# EAGLE design BradBoxV4 (EAGLE 6.3)
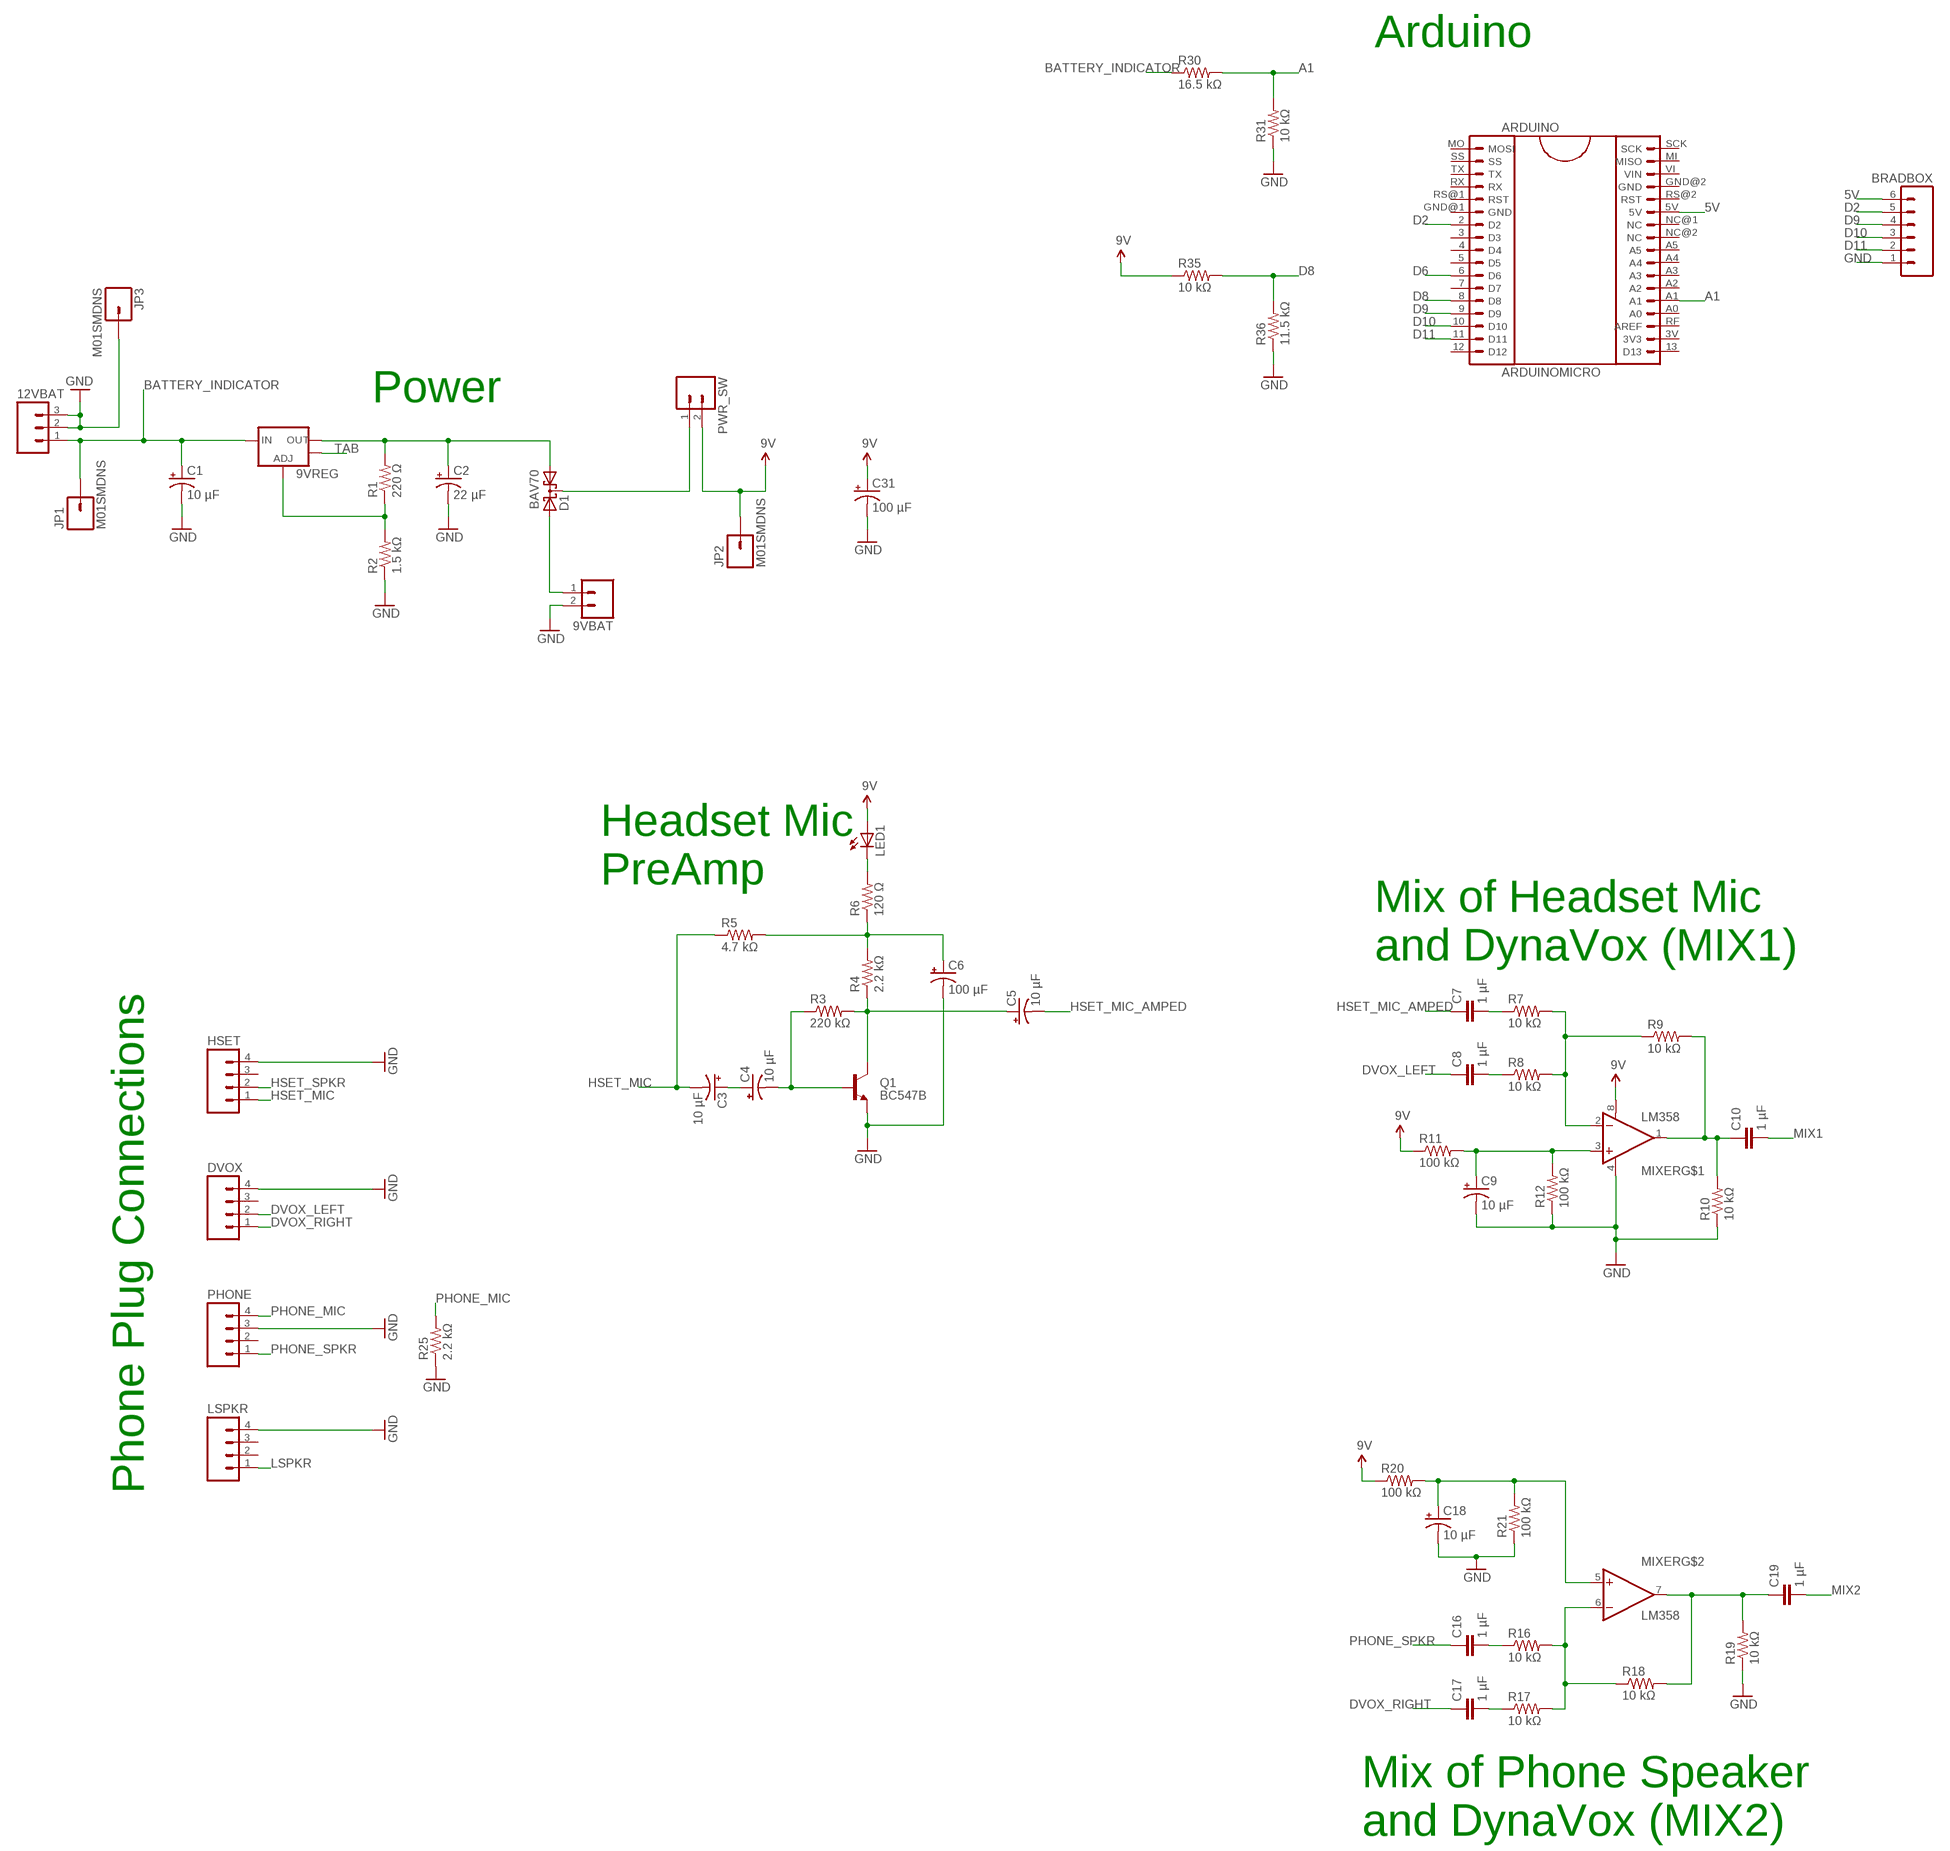
[diagram p0: schematic, sheet 1, part 1 of 2]
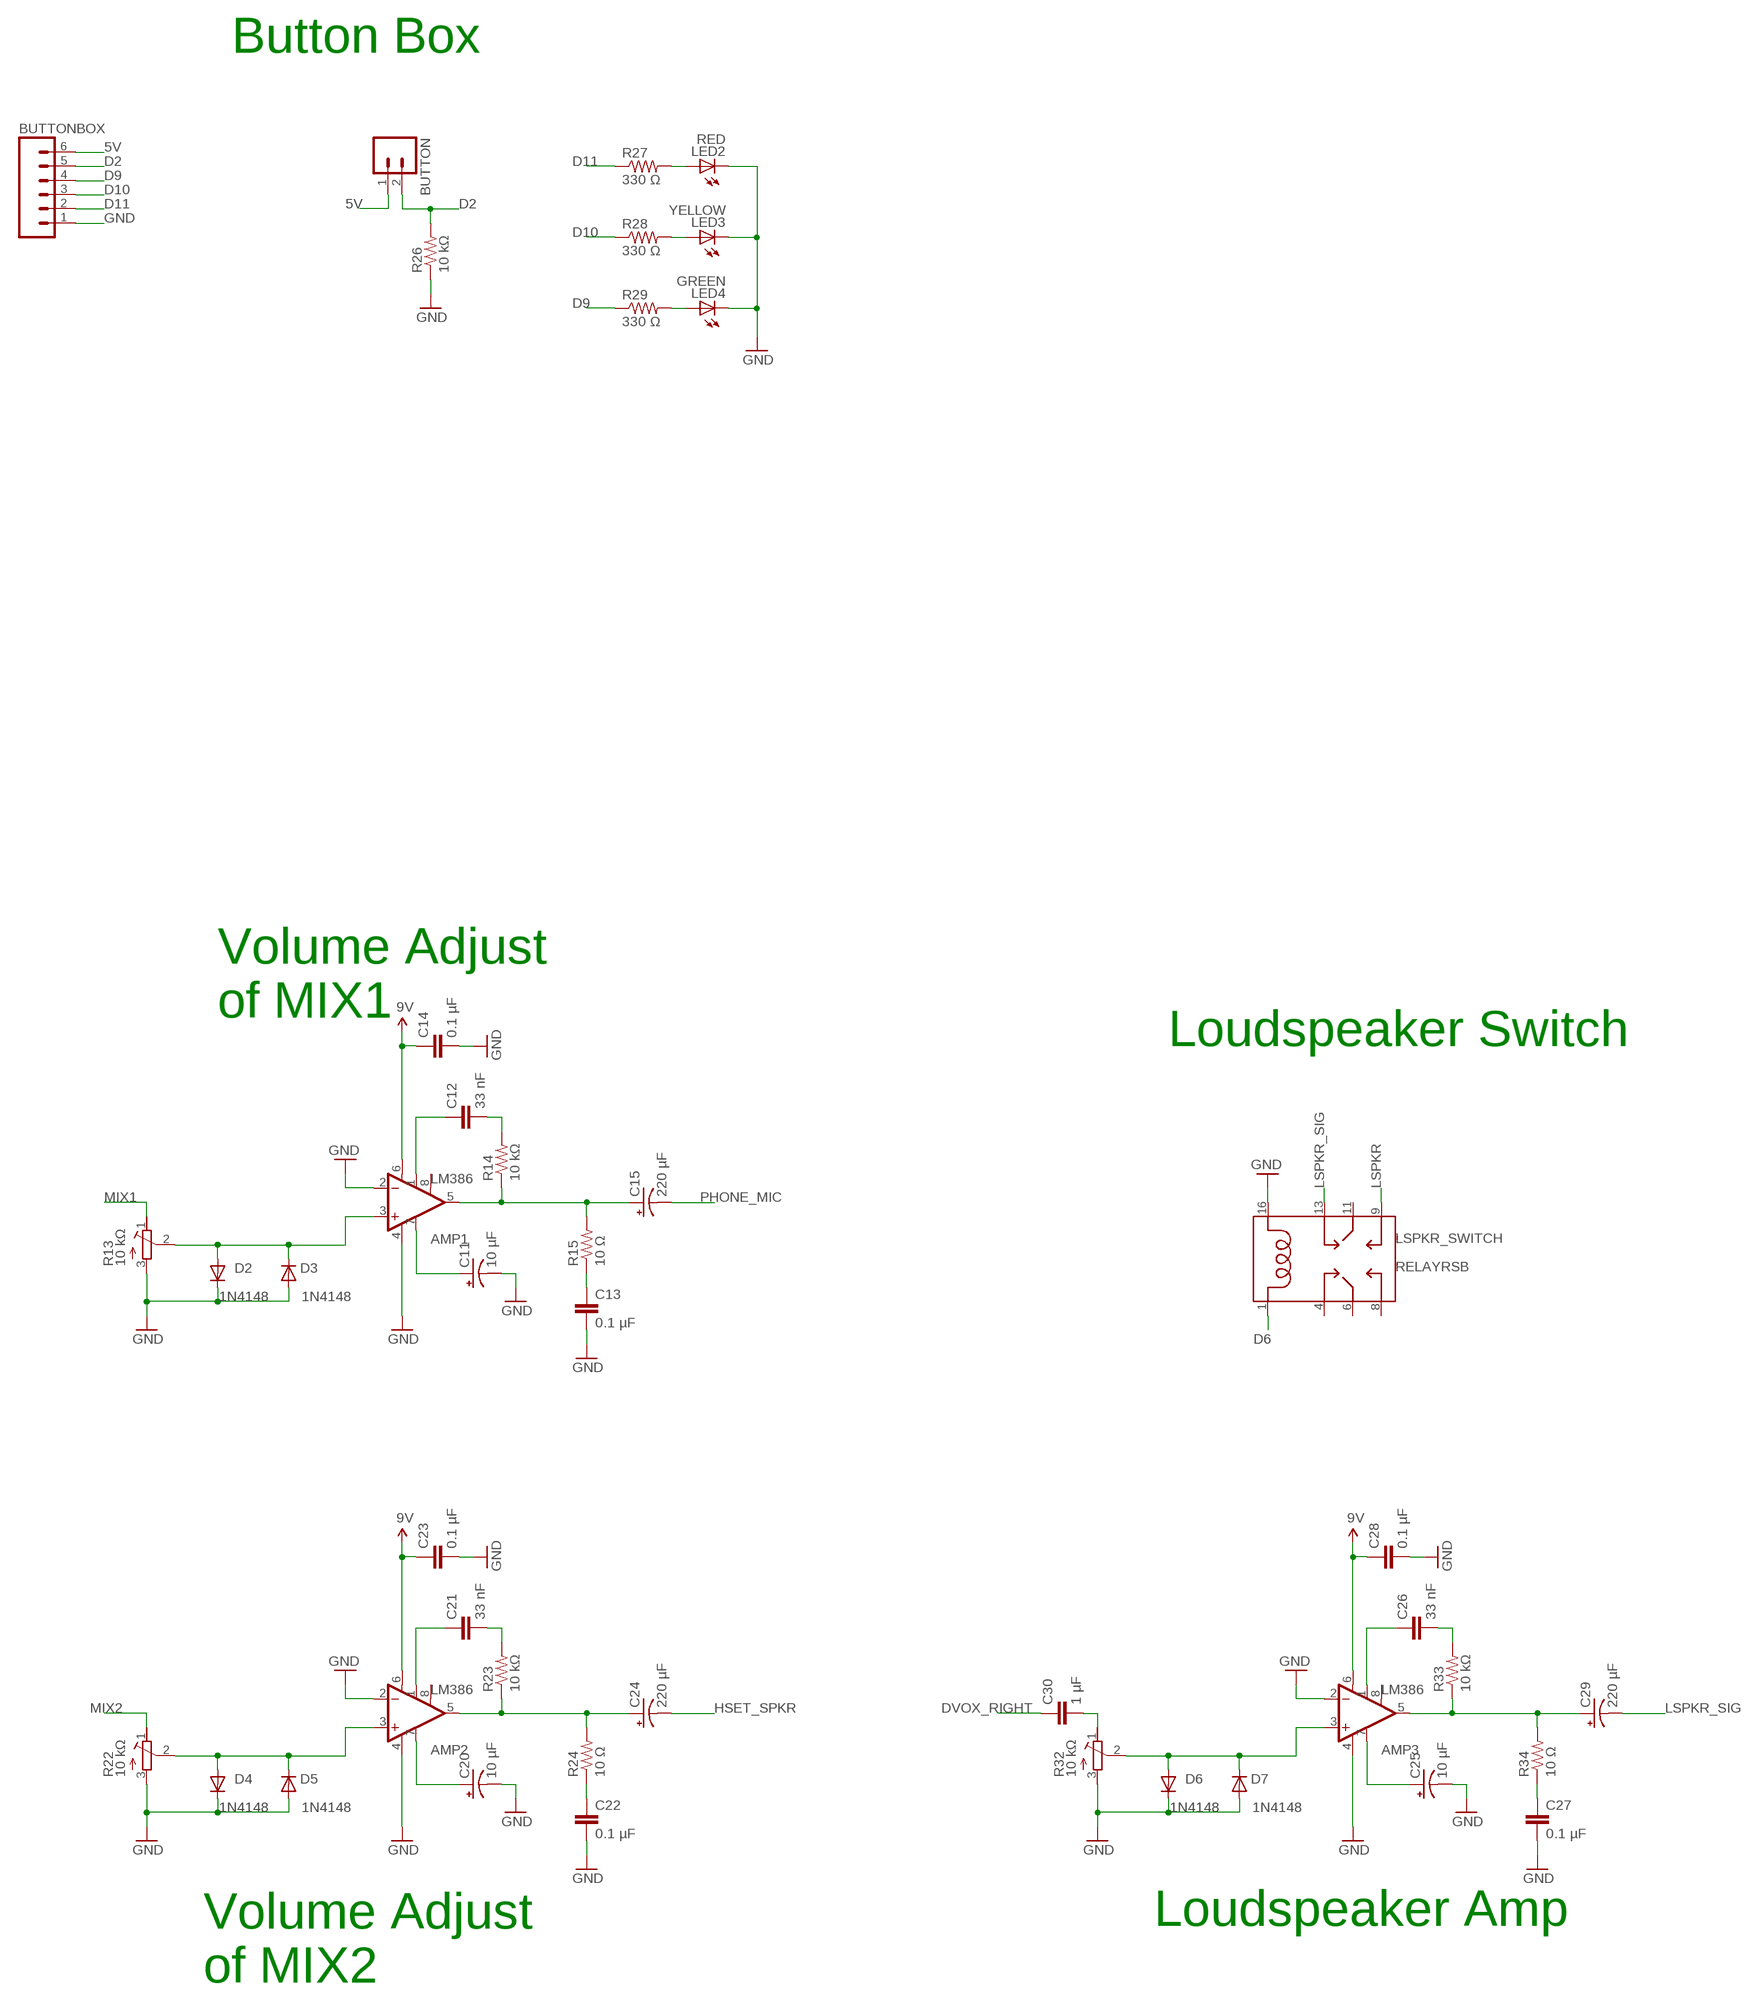
[diagram p1: schematic, sheet 1, part 2 of 2]

## Parts
9VBAT  M02POLAR  [MOLEX-1X2]
9VREG  V_REG_LM1117SOT223  [SOT223]
12VBAT  M03POLAR  [MOLEX-1X3]
AMP1  LM386  [DIP08]
AMP2  LM386  [DIP08]
AMP3  LM386  [DIP08]
ARDUINO  ARDUINOMICRO  [ARDUINO_MICRO]
BRADBOX  M06POLAR  [MOLEX-1X6]
BUTTON  M02POLAR  [MOLEX-1X2]
BUTTONBOX  M06POLAR  [MOLEX-1X6]
C1  10 µF  CAP_POL0603-POL  [0603-CAP-POL]
C2  22 µF  CAP_POL0603-POL  [0603-CAP-POL]
C3  10 µF  CAP_POL0603-POL  [0603-CAP-POL]
C4  10 µF  CAP_POL0603-POL  [0603-CAP-POL]
C5  10 µF  CAP_POL0603-POL  [0603-CAP-POL]
C6  100 µF  CAP_POLPTH1  [CPOL-RADIAL-100UF-100V]
C7  1 µF  CAP0603-CAP  [0603-CAP]
C8  1 µF  CAP0603-CAP  [0603-CAP]
C9  10 µF  CAP_POL0603-POL  [0603-CAP-POL]
C10  1 µF  CAP0603-CAP  [0603-CAP]
C11  10 µF  CAP_POL0603-POL  [0603-CAP-POL]
C12  33 nF  CAP0603-CAP  [0603-CAP]
C13  0.1 µF  CAP0603-CAP  [0603-CAP]
C14  0.1 µF  CAP0603-CAP  [0603-CAP]
C15  220 µF  CAP_POLPTH4  [CPOL-RADIAL-220UF-100V]
C16  1 µF  CAP0603-CAP  [0603-CAP]
C17  1 µF  CAP0603-CAP  [0603-CAP]
C18  10 µF  CAP_POL0603-POL  [0603-CAP-POL]
C19  1 µF  CAP0603-CAP  [0603-CAP]
C20  10 µF  CAP_POL0603-POL  [0603-CAP-POL]
C21  33 nF  CAP0603-CAP  [0603-CAP]
C22  0.1 µF  CAP0603-CAP  [0603-CAP]
C23  0.1 µF  CAP0603-CAP  [0603-CAP]
C24  220 µF  CAP_POLPTH4  [CPOL-RADIAL-220UF-100V]
C25  10 µF  CAP_POL0603-POL  [0603-CAP-POL]
C26  33 nF  CAP0603-CAP  [0603-CAP]
C27  0.1 µF  CAP0603-CAP  [0603-CAP]
C28  0.1 µF  CAP0603-CAP  [0603-CAP]
C29  220 µF  CAP_POLPTH4  [CPOL-RADIAL-220UF-100V]
C30  1 µF  CAP0603-CAP  [0603-CAP]
C31  100 µF  CAP_POLPTH1  [CPOL-RADIAL-100UF-100V]
D1  BAV70  BAS70-05  [SOT23]
D2  1N4148  DIODE-SOD523F  [SOD523F]
D3  1N4148  DIODE-SOD523F  [SOD523F]
D4  1N4148  DIODE-SOD523F  [SOD523F]
D5  1N4148  DIODE-SOD523F  [SOD523F]
D6  1N4148  DIODE-SOD523F  [SOD523F]
D7  1N4148  DIODE-SOD523F  [SOD523F]
DVOX  M04POLAR  [MOLEX-1X4]
HSET  M04POLAR  [MOLEX-1X4]
JP1  M01SMDNS  [1X01NS]
JP2  M01SMDNS  [1X01NS]
JP3  M01SMDNS  [1X01NS]
LED1  LED0603  [LED-0603]
LED2  RED  LED5MM  [LED5MM]
LED3  YELLOW  LED5MM  [LED5MM]
LED4  GREEN  LED5MM  [LED5MM]
LSPKR  M04POLAR  [MOLEX-1X4]
LSPKR_SWITCH  RELAYRSB  [RELAY-RSB]
MIXER  LM358  [DIP08]
PHONE  M04POLAR  [MOLEX-1X4]
PWR_SW  M02POLAR  [MOLEX-1X2]
Q1  BC547B  TRANSISTOR_NPNTO-92-AMMO  [TO-92-AMMO]
R1  220 Ω  R-US_R0603  [R0603]
R2  1.5 kΩ  R-US_R0603  [R0603]
R3  220 kΩ  R-US_R0603  [R0603]
R4  2.2 kΩ  R-US_R0603  [R0603]
R5  4.7 kΩ  R-US_R0603  [R0603]
R6  120 Ω  R-US_R0603  [R0603]
R7  10 kΩ  R-US_R0603  [R0603]
R8  10 kΩ  R-US_R0603  [R0603]
R9  10 kΩ  R-US_R0603  [R0603]
R10  10 kΩ  R-US_R0603  [R0603]
R11  100 kΩ  R-US_R0603  [R0603]
R12  100 kΩ  R-US_R0603  [R0603]
R13  10 kΩ  R-TRIMMT93YA  [RTRIMT93YA]
R14  10 kΩ  R-US_R0603  [R0603]
R15  10 Ω  R-US_R0603  [R0603]
R16  10 kΩ  R-US_R0603  [R0603]
R17  10 kΩ  R-US_R0603  [R0603]
R18  10 kΩ  R-US_R0603  [R0603]
R19  10 kΩ  R-US_R0603  [R0603]
R20  100 kΩ  R-US_R0603  [R0603]
R21  100 kΩ  R-US_R0603  [R0603]
R22  10 kΩ  R-TRIMMT93YA  [RTRIMT93YA]
R23  10 kΩ  R-US_R0603  [R0603]
R24  10 Ω  R-US_R0603  [R0603]
R25  2.2 kΩ  R-US_R0603  [R0603]
R26  10 kΩ  R-US_R0603  [R0603]
R27  330 Ω  R-US_R0603  [R0603]
R28  330 Ω  R-US_R0603  [R0603]
R29  330 Ω  R-US_R0603  [R0603]
R30  16.5 kΩ  R-US_R0603  [R0603]
R31  10 kΩ  R-US_R0603  [R0603]
R32  10 kΩ  R-TRIMMT93YA  [RTRIMT93YA]
R33  10 kΩ  R-US_R0603  [R0603]
R34  10 Ω  R-US_R0603  [R0603]
R35  10 kΩ  R-US_R0603  [R0603]
R36  11.5 kΩ  R-US_R0603  [R0603]

## Nets
5V: ARDUINO.5V BRADBOX.6 BUTTON.1 BUTTONBOX.6
9V: AMP1.6(V+) AMP2.6(V+) AMP3.6(V+) C14.1 C23.1 C28.1 C31.1(+) JP2.1 LED1.A MIXER.8(V+) PWR_SW.2 R11.1 R20.1 R35.1
A1: ARDUINO.A1 R30.2 R31.2
BATTERY_INDICATOR: 9VREG.3(IN) 12VBAT.1 C1.1(+) JP1.1 R30.1
D2: ARDUINO.2(D2) BRADBOX.5 BUTTON.2 BUTTONBOX.5 R26.2
D6: ARDUINO.6(D6) LSPKR_SWITCH.1
D8: ARDUINO.8(D8) R35.2 R36.2
D9: ARDUINO.9(D9) BRADBOX.4 BUTTONBOX.4 R29.1
D10: ARDUINO.10(D10) BRADBOX.3 BUTTONBOX.3 R28.1
D11: ARDUINO.11(D11) BRADBOX.2 BUTTONBOX.2 R27.1
DVOX_LEFT: C8.1 DVOX.2
DVOX_RIGHT: C17.1 C30.1 DVOX.1
GND: 9VBAT.2 12VBAT.2 12VBAT.3 AMP1.2(-IN) AMP1.4(V-) AMP2.2(-IN) AMP2.4(V-) AMP3.2(-IN) AMP3.4(V-) BRADBOX.1 BUTTONBOX.1 C1.2(-) C2.2(-) C6.2(-) C9.2(-) C11.2(-) C13.2 C14.2 C18.2(-) C20.2(-) C22.2 C23.2 C25.2(-) C27.2 C28.2 C31.2(-) D2.C D3.A D4.C D5.A D6.C D7.A DVOX.4 HSET.4 JP3.1 LED2.K(C) LED3.K(C) LED4.K(C) LSPKR.4 LSPKR_SWITCH.16 MIXER.4(V-) PHONE.3 Q1.1(E) R2.1 R10.1 R12.1 R13.3(E) R19.1 R21.1 R22.3(E) R25.1 R26.1 R31.1 R32.3(E) R36.1
HSET_MIC: C3.2(-) HSET.1 R5.1
HSET_MIC_AMPED: C5.2(-) C7.1
HSET_SPKR: C24.2(-) HSET.2
LSPKR: LSPKR.1 LSPKR_SWITCH.9
LSPKR_SIG: C29.2(-) LSPKR_SWITCH.13
MIX1: C10.2 R13.1(A)
MIX2: C19.2 R22.1(A)
N$1: 9VREG.2(OUT) C2.1(+) D1.1(A1) R1.2
N$2: 9VREG.1(ADJ) R1.1 R2.2
N$3: AMP3.3(+IN) D6.A D7.C R32.2(S)
N$4: D1.3(C) PWR_SW.1
N$5: 9VBAT.1 D1.2(A2)
N$6: C3.1(+) C4.1(+)
N$7: C4.2(-) Q1.2(B) R3.1
N$8: C5.1(+) Q1.3(C) R3.2 R4.1
N$9: LED1.C R6.2
N$10: C6.1(+) R4.2 R5.2 R6.1
N$11: C8.2 R8.1
N$12: C7.2 R7.1
N$13: MIXER.2(-IN) R7.2 R8.2 R9.1
N$14: C10.1 MIXER.1(OUT) R9.2 R10.2
N$15: C9.1(+) MIXER.3(+IN) R11.2 R12.2
N$16: AMP1.1(GAIN) C12.1
N$17: C12.2 R14.2
N$18: AMP1.3(+IN) D2.A D3.C R13.2(S)
N$19: AMP1.5(OUT) C15.1(+) R14.1 R15.2
N$20: AMP1.7(BP) C11.1(+)
N$21: C13.1 R15.1
N$22: C17.2 R17.1
N$23: C16.2 R16.1
N$24: C18.1(+) MIXER.5(+IN) R20.2 R21.2
N$25: MIXER.6(-IN) R16.2 R17.2 R18.1
N$26: C19.1 MIXER.7(OUT) R18.2 R19.2
N$27: AMP2.3(+IN) D4.A D5.C R22.2(S)
N$28: AMP2.7(BP) C20.1(+)
N$29: AMP2.1(GAIN) C21.1
N$30: C21.2 R23.2
N$31: AMP2.5(OUT) C24.1(+) R23.1 R24.2
N$32: C22.1 R24.1
N$34: LED2.A R27.2
N$35: LED3.A R28.2
N$36: LED4.A R29.2
N$37: AMP3.7(BP) C25.1(+)
N$38: AMP3.1(GAIN) C26.1
N$39: C26.2 R33.2
N$40: AMP3.5(OUT) C29.1(+) R33.1 R34.2
N$41: C27.1 R34.1
N$42: C30.2 R32.1(A)
PHONE_MIC: C15.2(-) PHONE.4 R25.2
PHONE_SPKR: C16.1 PHONE.1
TAB: 9VREG.4(OUT)
Unconnected: AMP1.8(GAIN) AMP2.8(GAIN) AMP3.8(GAIN) ARDUINO.3(D3) ARDUINO.3V(3V3) ARDUINO.4(D4) ARDUINO.5(D5) ARDUINO.7(D7) ARDUINO.12(D12) ARDUINO.13(D13) ARDUINO.A0 ARDUINO.A2 ARDUINO.A3 ARDUINO.A4 ARDUINO.A5 ARDUINO.GND@1(GND) ARDUINO.GND@2(GND) ARDUINO.MI(MISO) ARDUINO.MO(MOSI) ARDUINO.NC@1(NC) ARDUINO.NC@2(NC) ARDUINO.RF(AREF) ARDUINO.RS@1(RST) ARDUINO.RS@2(RST) ARDUINO.RX ARDUINO.SCK ARDUINO.SS ARDUINO.TX ARDUINO.VI(VIN) DVOX.3 HSET.3 LSPKR.2 LSPKR.3 LSPKR_SWITCH.4 LSPKR_SWITCH.6 LSPKR_SWITCH.8 LSPKR_SWITCH.11 PHONE.2

## Notes on the sheet
- Arduino
- Button Box
- Power
- Headset Mic 
  PreAmp
- Mix of Headset Mic
  and DynaVox (MIX1)
- Volume Adjust
  of MIX1
- Loudspeaker Switch
- Phone Plug Connections
- Loudspeaker Amp
- Mix of Phone Speaker
  and DynaVox (MIX2)
- Volume Adjust
  of MIX2

## Library data of the parts
9VBAT BUTTON PWR_SW = BradBoxV4:M02: Header 2 Standard 2-pin 0.1" header. Use with straight break away headers (SKU : PRT-00116), right angle break away headers (PRT-00553), swiss pins (PRT-00743), machine pins (PRT-00117), and female headers (PRT-00115). Molex polarized connector foot print use with SKU : PRT-08233 with associated crimp pins and housings.
9VREG = BradBoxV4:V_REG_LM1117: Voltage Regulator LM1117 Standard adjustable voltage regulator but in SMD form. Spark Fun Electronics SKU : COM-00595
12VBAT = BradBoxV4:M03: Header 3 Standard 3-pin 0.1" header. Use with straight break away headers (SKU : PRT-00116), right angle break away headers (PRT-00553), swiss pins (PRT-00743), machine pins (PRT-00117), and female headers (PRT-00115). Molex polarized connector foot print use with SKU : PRT-08232 with associated crimp pins and housings.
AMP1-AMP3 = BradBoxV4:LM386: low voltage audio power amplifier
ARDUINO = BradBoxV4:ARDUINO
BRADBOX BUTTONBOX = BradBoxV4:M06: Header 6 Standard 6-pin 0.1" header. Use with straight break away headers (SKU : PRT-00116), right angle break away headers (PRT-00553), swiss pins (PRT-00743), machine pins (PRT-00117), and female headers (PRT-00115). Molex polarized connector foot print use with SKU : PRT-08094 with associated crimp pins and housings. NOTES ON THE VARIANTS LOCK and LOCK_LONGPADS... This footprint was designed to help hold the alignment of a through-hole component (i.e. 6-pin header) while soldering it into place. You may notice that each hole has been shifted either up or down by 0.005 of an inch from it's more standard position (which is a perfectly straight line). This slight alteration caused the pins (the squares in the middle) to touch the edges of the holes. Because they are alternating, it causes a "brace" to hold the component in place. 0.005 has proven to be the perfect amount of "off-center" position when using our standard breakaway headers. Although looks a little odd when you look at the bare footprint, once you have a header in there, the alteration is very hard to notice. Also, if you push a header all the way into place, it is covered up entirely on the bottom side. This idea of altering the position of holes to aid alignment will be further integrated into the Sparkfun Library for other footprints. It can help hold any component with 3 or more connection pins.
C1-C6 C9 C11 C15 C18 C20 C24 C25 C29 C31 = BradBoxV4:CAP_POL: Capacitor Polarized These are standard SMD and PTH capacitors. Normally 10uF, 47uF, and 100uF in electrolytic and tantalum varieties. Always verify the external diameter of the through hole cap, it varies with capacity, voltage, and manufacturer. The EIA devices should be standard.
C7 C8 C10 C12-C14 C16 C17 C19 C21-C23 C26-C28 C30 = BradBoxV4:CAP: Capacitor Standard 0603 ceramic capacitor, and 0.1" leaded capacitor.
D1 = BradBoxV4:BAS70-05: Silicon Schottky Diodes General-purpose diode for high-speed switching
D2-D7 = BradBoxV4:DIODE-: DIODE
DVOX HSET LSPKR PHONE = BradBoxV4:M04: Header 4 Standard 4-pin 0.1" header. Use with straight break away headers (SKU : PRT-00116), right angle break away headers (PRT-00553), swiss pins (PRT-00743), machine pins (PRT-00117), and female headers (PRT-00115). Molex polarized connector foot print use with SKU : PRT-08231 with associated crimp pins and housings. 1MM SMD Version SKU: PRT-10208
JP1-JP3 = BradBoxV4:M01: Header 1 Standard 1-pin 0.1" header. Use with straight break away headers (SKU : PRT-00116), right angle break away headers (PRT-00553), swiss pins (PRT-00743), machine pins (PRT-00117), and female headers (PRT-00115).
LED1-LED4 = BradBoxV4:LED: LEDs Standard schematic elements and footprints for 5mm, 3mm, 1206, and 0603 sized LEDs. 5mm - Spark Fun Electronics SKU : COM-00529 (and others)
LSPKR_SWITCH = BradBoxV4:RELAY: SPDT relay (COM-00101)
MIXER = BradBoxV4:LM358
Q1 = BradBoxV4:TRANSISTOR_NPN: Generic NPN BJT. MMBT2222 is the common NPN we use. Double check against datasheet- not all devices are the same!
R1-R12 R14-R21 R23-R31 R33-R36 = BradBoxV4:R-US_: RESISTOR, American symbol
R13 R22 R32 = BradBoxV4:R-TRIMM: Trimm resistor

## Board
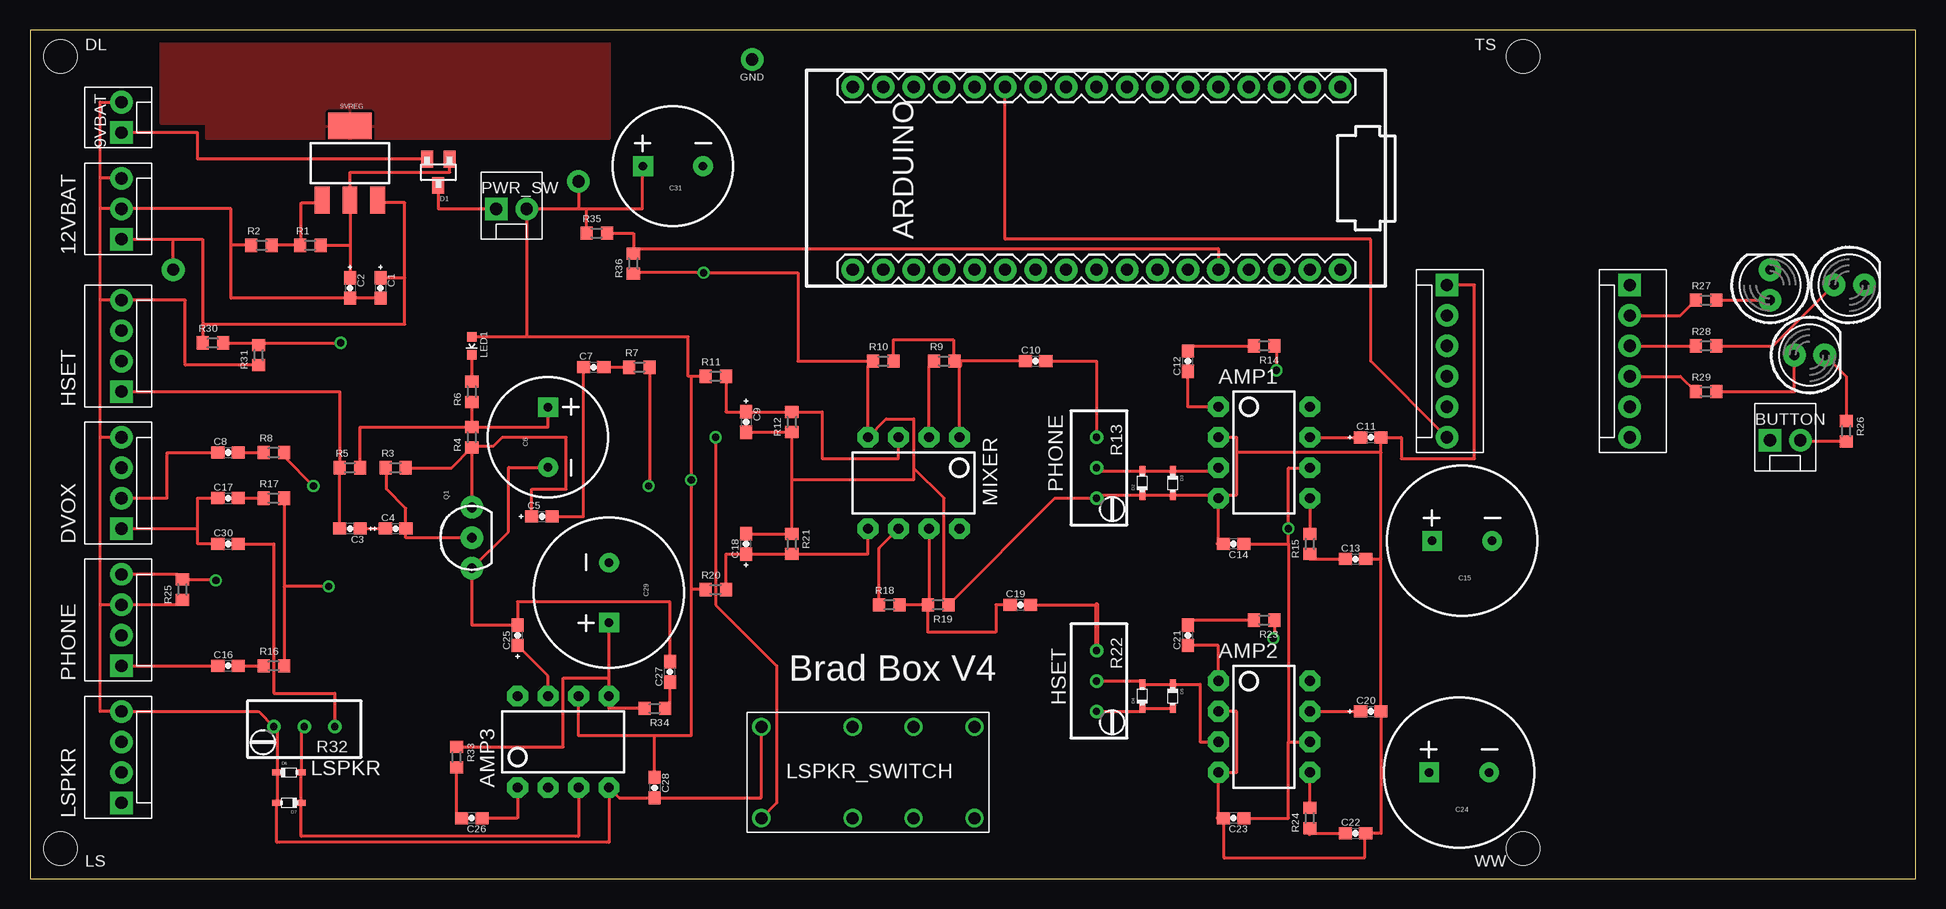
[diagram p2: board, top side]
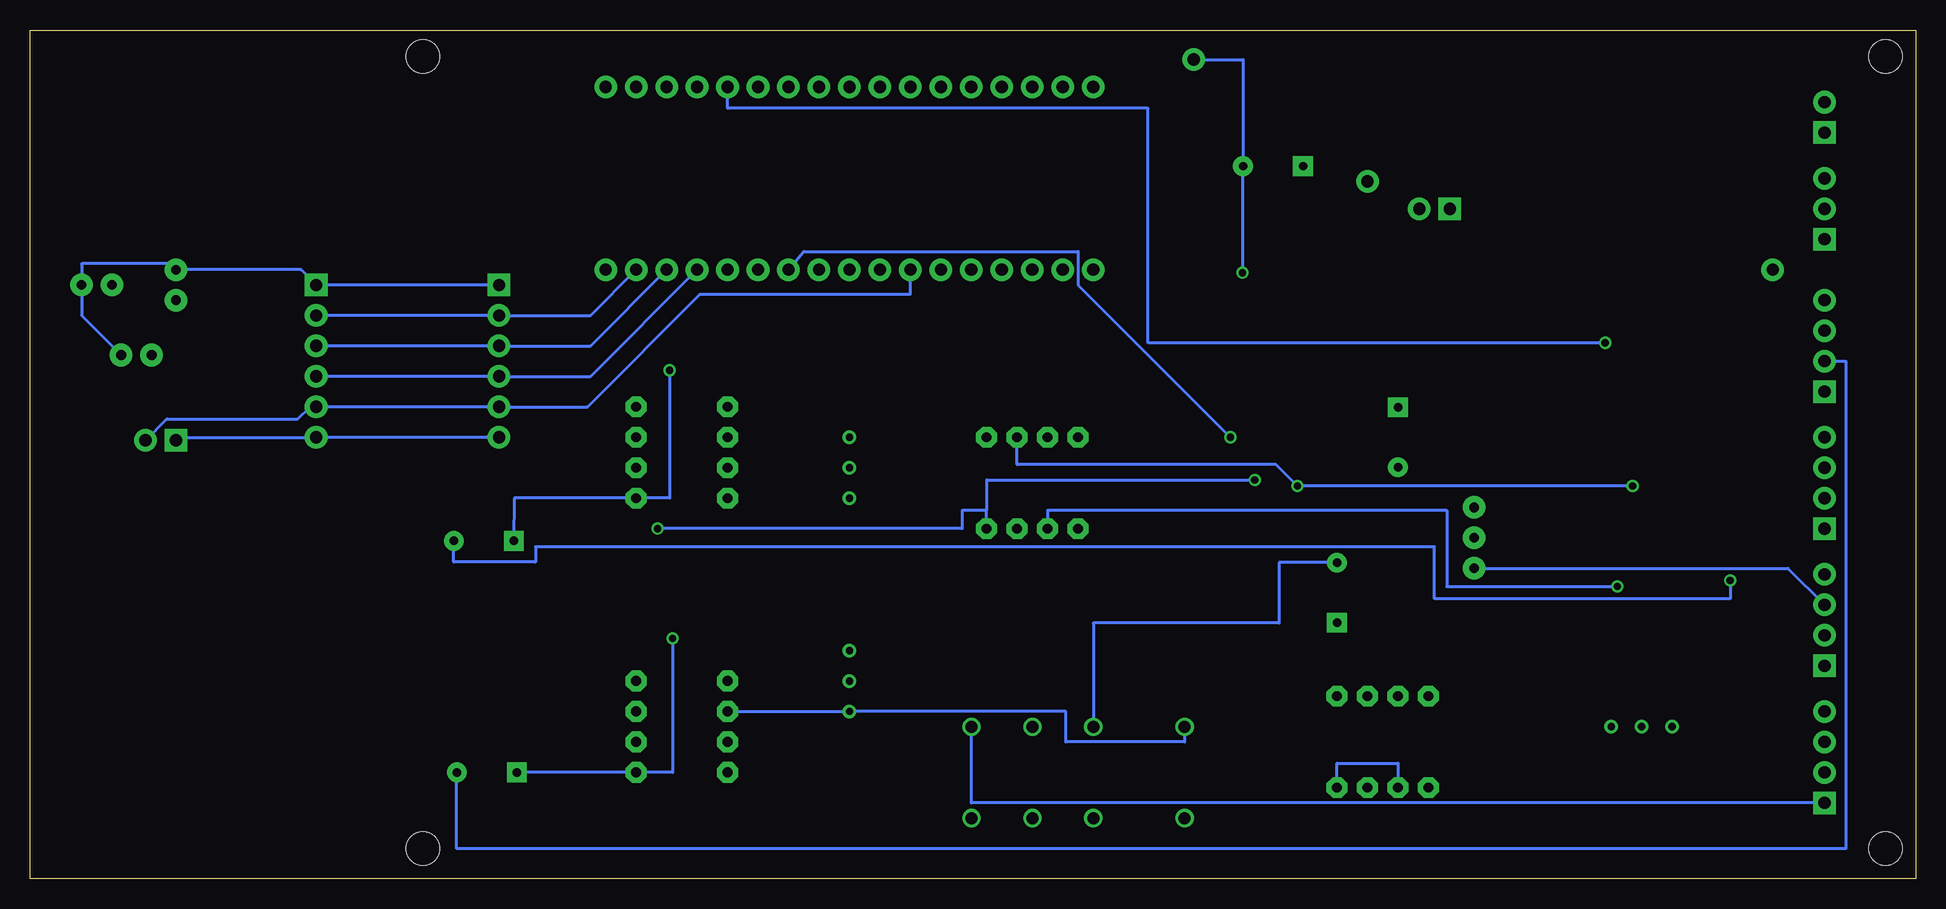
[diagram p3: board, bottom side, seen from below]

Size 157.21 x 70.79 mm. Coordinates in mm from the lower left corner, seen from the top.
Outline: 0,0 157.21,0 157.21,70.79 0,70.79 0,0
Copper layers (1*16): Top 0.035mm / dielectric 1.5mm / Bottom 0.035mm
Design rules "default": minimum track width 10mil, minimum drill 24mil, track to track 8mil, track to pad 8mil, pad to pad 8mil, via to via 8mil, smd to smd 8mil, copper to edge 40mil, drill to drill 8mil, minimum pad ring 10mil, minimum via ring 8mil, stop-mask expansion 4mil, vias tented up to drill 0mil, thermal gap 10mil
Holes 2.8 mm at 2.54,2.54 2.54,68.58 124.46,2.54 124.46,68.58

### Footprints (pad centres in the part's own frame; a part is rotated, then mirrored left to right if it is on the bottom)
MOLEX-1X2 = drill 1.016 pad 1.88 square: 1 0,0 | drill 1.016 pad 1.88: 2 2.54,0
SOT223 = smd 1.219 x 2.235: 1 -2.311,-3.099; 2 0,-3.099; 3 2.311,-3.099 | smd 3.6 x 2.2: 4 0,3.099
MOLEX-1X3 = drill 1.016 pad 1.88 square: 1 0,0 | drill 1.016 pad 1.88: 2 2.54,0; 3 5.08,0
DIP08 = drill 0.813 pad 1.727 octagon: 1 -3.81,-3.81; 2 -1.27,-3.81; 3 1.27,-3.81; 4 3.81,-3.81; 5 3.81,3.81; 6 1.27,3.81; 7 -1.27,3.81; 8 -3.81,3.81
ARDUINO_MICRO = drill 1.016 pad 1.88: 2 -7.62,25.4; 3 -7.62,22.86; 3V 7.62,2.54; 4 -7.62,20.32; 5 -7.62,17.78; 5V 7.62,27.94; 6 -7.62,15.24; 7 -7.62,12.7; 8 -7.62,10.16; 9 -7.62,7.62; 10 -7.62,5.08; 11 -7.62,2.54; 12 -7.62,0; 13 7.62,0; A0 7.62,7.62; A1 7.62,10.16; A2 7.62,12.7; A3 7.62,15.24; A4 7.62,17.78; A5 7.62,20.32; GND@1 -7.62,27.94; GND@2 7.62,33.02; MI 7.62,38.1; MO -7.62,40.64; NC@1 7.62,25.4; NC@2 7.62,22.86; RF 7.62,5.08; RS@1 -7.62,30.48; RS@2 7.62,30.48; RX -7.62,33.02; SCK 7.62,40.64; SS -7.62,38.1; TX -7.62,35.56; VI 7.62,35.56
MOLEX-1X6 = drill 1.016 pad 1.88 square: 1 0,0 | drill 1.016 pad 1.88: 2 2.54,0; 3 5.08,0; 4 7.62,0; 5 10.16,0; 6 12.7,0
0603-CAP-POL = smd 1.1 x 1: 1 -0.85,0; 2 0.85,0
CPOL-RADIAL-100UF-100V = drill 0.7 pad 1.651 square: 1 2.5,0 | drill 0.7 pad 1.651: 2 -2.5,0
0603-CAP = smd 1.1 x 1: 1 -0.85,0; 2 0.85,0
CPOL-RADIAL-220UF-100V = drill 0.7 pad 1.651 square: 1 2.5,0 | drill 0.7 pad 1.651: 2 -2.5,0
SOT23 = smd 1 x 1.4: 1 -0.95,-1.1; 2 0.95,-1.1; 3 0,1.1
SOD523F = smd 0.8 x 0.5: A 1,0; C -1,0
MOLEX-1X4 = drill 1.016 pad 1.88 square: 1 0,0 | drill 1.016 pad 1.88: 2 2.54,0; 3 5.08,0; 4 7.62,0
1X01NS = drill 1.016 pad 1.88: 1 0,0
LED-0603 = smd 0.8 x 0.8: A 0,-0.75; C 0,0.75
LED5MM = drill 0.813 pad 1.88: A -1.27,0; K 1.27,0
RELAY-RSB = drill 1: 1 -8.89,-3.81; 4 -1.27,-3.81; 6 3.81,-3.81; 8 8.89,-3.81; 9 8.89,3.81; 11 3.81,3.81; 13 -1.27,3.81; 16 -8.89,3.81
TO-92-AMMO = drill 0.813 pad 1.88: 1 -2.54,0; 2 0,0; 3 2.54,0
R0603 = smd 1 x 1.1: 1 -0.85,0; 2 0.85,0
RTRIMT93YA = drill 0.61: 1 0,-2.54; 2 0,0; 3 0,2.54

### Placement (x,y rotation side)
9VBAT  7.62,62.23 90 top
9VREG  26.67,59.69 0 top
12VBAT  7.62,53.34 90 top
AMP1  102.87,35.56 270 top
AMP2  102.87,12.7 270 top
AMP3  44.45,11.43 0 top
ARDUINO  109.22,58.42 90 top
BRADBOX  118.11,49.53 270 top
BUTTON  145.03,36.58 0 top
BUTTONBOX  133.35,49.53 270 top
C1  29.21,49.28 270 top
C2  26.67,49.28 270 top
C3  26.67,29.21 180 top
C4  30.48,29.21 0 top
C5  42.67,30.23 0 top
C6  43.18,36.83 90 top
C7  46.99,42.67 0 top
C8  16.51,35.56 0 top
C9  59.69,38.1 270 top
C10  83.82,43.18 0 top
C11  111.76,36.83 0 top
C12  96.52,43.18 90 top
C13  110.49,26.67 0 top
C14  100.33,27.94 180 top
C15  119.38,28.19 180 top
C16  16.51,17.78 0 top
C17  16.51,31.75 0 top
C18  59.69,27.94 90 top
C19  82.55,22.86 0 top
C20  111.76,13.97 0 top
C21  96.52,20.32 90 top
C22  110.49,3.81 0 top
C23  100.33,5.08 180 top
C24  119.13,8.89 180 top
C25  40.64,20.32 90 top
C26  36.83,5.08 180 top
C27  53.34,17.27 90 top
C28  52.07,7.62 270 top
C29  48.26,23.88 270 top
C30  16.51,27.94 0 top
C31  53.59,59.44 180 top
D1  34.04,58.93 180 top
D2  92.71,33.02 90 top
D3  95.25,33.02 270 top
D4  92.71,15.24 90 top
D5  95.25,15.24 270 top
D6  21.59,8.89 0 top
D7  21.59,6.35 180 top
DVOX  7.62,29.21 90 top
HSET  7.62,40.64 90 top
JP1  11.94,50.8 0 top
JP2  45.72,58.17 0 top
JP3  60.2,68.33 0 top
LED1  36.83,44.45 180 top
LED2  145.03,49.53 90 top
LED3  151.64,49.53 0 top
LED4  148.34,43.69 0 top
LSPKR  7.62,6.35 90 top
LSPKR_SWITCH  69.85,8.89 0 top
MIXER  73.66,33.02 180 top
PHONE  7.62,17.78 90 top
PWR_SW  38.86,55.88 0 top
Q1  36.83,28.45 90 top
R1  23.37,52.83 0 top
R2  19.3,52.83 0 top
R3  30.48,34.29 0 top
R4  36.83,36.83 90 top
R5  26.67,34.29 0 top
R6  36.83,40.64 90 top
R7  50.8,42.67 0 top
R8  20.32,35.56 0 top
R9  76.2,43.18 0 top
R10  71.12,43.18 0 top
R11  57.15,41.91 0 top
R12  63.5,38.1 90 top
R13  88.9,34.29 180 top
R14  102.87,44.45 180 top
R15  106.68,27.94 90 top
R16  20.32,17.78 0 top
R17  20.32,31.75 0 top
R18  71.63,22.86 0 top
R19  75.69,22.86 180 top
R20  57.15,24.13 0 top
R21  63.5,27.94 270 top
R22  88.9,16.51 180 top
R23  102.87,21.59 180 top
R24  106.68,5.08 90 top
R25  12.7,24.13 90 top
R26  151.38,37.34 270 top
R27  139.7,48.26 0 top
R28  139.7,44.45 0 top
R29  139.7,40.64 0 top
R30  15.24,44.7 0 top
R31  19.05,43.69 90 top
R32  22.86,12.7 90 top
R33  35.56,10.16 270 top
R34  52.07,14.22 180 top
R35  47.24,53.85 0 top
R36  50.29,51.31 90 top

### Tracks (layer width: path | path; a pad name or v marks a point on that pad's centre or on a via)
5V
  Top 0.254: BRADBOX.6 111.76,43.18 111.76,53.34 81.28,53.34 ARDUINO.5V
  Bottom 0.254: BUTTON.1 144.78,36.83 BUTTONBOX.6 BRADBOX.6
9V  (via drill 0.6)
  Top 0.254: 45.72,55.88 PWR_SW.2 41.4,45.2 | 45.72,55.88 46.39,55.88 | 46.39,55.88 51.05,55.88 51.05,59.4 | R35.1 46.39,55.88 | 41.4,45.2 LED1.A | 41.4,45.2 54.86,45.2 54.86,41.91 R11.1 55.12,41.91 v55.12,33.27 55.12,24.13 | C28.1 52.07,11.94 | 52.07,11.94 45.72,11.94 AMP3.6 | 55.12,24.13 55.12,11.94 52.07,11.94 | R20.1 55.12,24.13 | C14.1 104.9,27.94 | 104.9,27.94 v104.9,29.21 104.9,34.29 AMP1.6 | C23.1 104.9,5.08 104.9,11.43 | 104.9,11.43 AMP2.6 | 104.9,27.94 104.9,11.43 | JP2.1 45.72,55.88
  Top 0.406: 51.05,59.4 C31.1
  Bottom 0.254: v55.12,33.27 77.47,33.27 77.47,30.73 | 77.47,30.73 79.5,30.73 79.5,29.21 v104.9,29.21 | MIXER.8 77.47,30.73
A1  (via drill 0.6)
  Top 0.254: R30.2 19.05,44.7 | 19.05,44.7 R31.2 | 19.05,44.7 v25.91,44.7
  Bottom 0.254: v25.91,44.7 64.01,44.7 64.01,64.26 99.06,64.26 ARDUINO.A1
BATTERY_INDICATOR
  Top 0.254: 12VBAT.1 11.94,53.34 | 11.94,53.34 14.39,53.34 14.39,46.23 | 14.39,46.23 R30.1 | 14.39,46.23 31.24,46.23 31.24,50.13 | 28.96,56.59 9VREG.3 28.98,56.39 31.24,56.39 31.24,50.13 | C1.1 31.24,50.13 | JP1.1 11.94,53.34
D2
  Top 0.254: R26.2 147.57,36.49 BUTTON.2
  Bottom 0.254: BUTTON.2 145.8,38.35 134.87,38.35 133.86,39.37 BUTTONBOX.5 BRADBOX.5 110.74,39.37 101.35,48.77 83.82,48.77 ARDUINO.2
D6  (via drill 0.61)
  Top 0.254: LSPKR_SWITCH.1 62.23,6.35 62.23,17.78 57.15,22.86 v57.15,36.83
  Bottom 0.254: v57.15,36.83 69.85,49.53 69.85,52.32 92.71,52.32 ARDUINO.6
D8
  Top 0.254: R35.2 50.29,53.85 R36.2 50.29,52.58 99.06,52.58 ARDUINO.8
D9
  Top 0.254: BUTTONBOX.4 137.58,41.91 R29.1
  Bottom 0.254: BUTTONBOX.4 BRADBOX.4 110.49,41.91 ARDUINO.9
D10
  Top 0.254: BUTTONBOX.3 R28.1
  Bottom 0.254: BUTTONBOX.3 BRADBOX.3 110.49,44.45 ARDUINO.10
D11
  Top 0.254: BUTTONBOX.2 137.58,46.99 R27.1
  Bottom 0.254: BUTTONBOX.2 BRADBOX.2 110.49,46.99 ARDUINO.11
DVOX_LEFT
  Top 0.254: DVOX.2 11.43,31.75 11.43,35.56 C8.1
DVOX_RIGHT
  Top 0.254: DVOX.1 13.97,29.21 | 13.97,29.21 13.97,31.75 C17.1 | C30.1 13.97,27.94 13.97,29.21
GND  (via drill 0.6)
  Top 0.254: 5.84,22.86 5.84,13.97 LSPKR.4 19.05,13.97 R32.3 20.59,12.43 D6.C D7.A 20.57,6.35 20.57,3.05 48.26,3.05 AMP3.4 49.11,6.77 C28.2 60.96,6.77 LSPKR_SWITCH.16 | 5.84,22.86 5.84,36.83 | 5.84,36.83 5.84,48.26 | 5.84,48.26 5.84,55.88 | 5.84,55.88 5.84,58.42 | 5.84,58.42 5.84,64.77 9VBAT.2 | 5.84,22.86 PHONE.3 12.28,22.86 R25.1 | DVOX.4 5.84,36.83 | 5.84,48.26 HSET.4 12.95,48.26 12.95,42.84 R31.1 | 12VBAT.3 5.84,58.42 | 5.84,55.88 12VBAT.2 16.76,55.88 16.76,52.83 | 16.76,52.83 16.76,48.43 C2.2 C1.2 | R2.1 16.76,52.83 | LED4.K 151.38,41.91 R26.1 | C9.2 R12.1 63.5,33.27 | 99.06,32.02 D3.A D2.C 88.9,32.02 R13.3 85.43,31.75 R19.1 76.2,22.86 76.2,31.75 73.66,34.29 | 99.06,32.02 AMP1.4 99.06,27.94 | C13.2 112.61,26.67 | 112.61,26.67 112.61,35.56 | 112.61,35.56 C11.2 114.3,36.83 114.3,35.05 120.4,35.05 120.4,49.53 BRADBOX.1 | 50.29,50.55 v56.13,50.55 64.01,50.55 64.01,43.18 R10.1 69.85,42.76 MIXER.4 71.37,38.35 73.66,38.35 73.66,34.29 | 63.5,33.27 R21.1 C18.2 59.69,28.7 | C6.2 39.92,34.33 39.88,34.29 39.88,28.96 Q1.1 36.83,21.17 C25.2 40.64,23.11 53.34,23.11 C27.2 | R22.3 92.71,13.97 D4.C D5.A | 99.06,5.08 AMP2.4 100.58,8.89 100.58,13.97 AMP2.2 | C23.2 99.48,1.78 111.25,1.78 111.25,3.81 | 99.06,32.02 100.58,32.02 100.58,35.56 | 100.58,35.56 100.58,36.83 AMP1.2 | 112.61,26.67 C20.2 112.61,3.81 C22.2 | 112.61,35.56 100.58,35.56 | 73.66,34.29 73.66,33.27 63.5,33.27
  Top 0.406: C14.2 99.06,27.94 | 50.29,50.55 R36.1 | C23.2 99.06,5.08 | 111.25,26.67 C13.2 | 111.25,3.81 C22.2
  Bottom 0.254: BRADBOX.1 BUTTONBOX.1 134.62,50.8 LED2.K 145.54,51.31 152.91,51.31 LED3.K 152.91,46.99 LED4.K | AMP3.4 48.26,9.65 43.18,9.65 AMP3.2 | v56.13,50.55 56.09,50.55 C31.2 56.09,68.33 JP3.1 | AMP2.2 R22.3 70.87,13.97 70.87,11.43 60.96,11.43 LSPKR_SWITCH.16 | Q1.1 10.67,25.91 PHONE.3
HSET_MIC
  Top 0.254: C3.2 R5.1 25.82,40.64 HSET.1
HSET_MIC_AMPED
  Top 0.254: C5.2 46.14,30.23 C7.1
HSET_SPKR
  Bottom 0.254: HSET.2 5.84,43.18 5.84,2.54 121.63,2.54 C24.2
LSPKR
  Bottom 0.254: LSPKR.1 78.74,6.35 LSPKR_SWITCH.9
LSPKR_SIG
  Bottom 0.254: C29.2 53.09,26.38 53.09,21.34 68.58,21.34 LSPKR_SWITCH.13
MIX1
  Top 0.254: C10.2 88.9,43.18 R13.1
MIX2
  Top 0.254: C19.2 88.9,22.86
  Top 0.406: 88.9,22.86 R22.1
N$1
  Top 0.254: 26.67,52.83 9VREG.2 26.67,58.93 34.99,58.93 D1.1 | 26.67,52.83 C2.1 | R1.2 26.67,52.83
N$2
  Top 0.254: 9VREG.1 24.36,56.39 22.61,56.39 22.61,52.83 R1.1 R2.2
N$3
  Top 0.254: R32.2 22.59,12.43 D6.A D7.C 22.61,6.35 22.61,3.56 45.72,3.56 AMP3.3
N$4
  Top 0.254: D1.3 34.04,55.88 PWR_SW.1
N$5
  Top 0.254: D1.2 13.97,60.03 13.97,62.23 9VBAT.1
N$6
  Top 0.254: C3.1 C4.1
N$7
  Top 0.254: R3.1 29.72,34.2 29.72,32.51 31.33,30.9 C4.2 31.33,28.45 Q1.2
N$8
  Top 0.254: R4.1 Q1.3 | R3.2 35.14,34.29 R4.1 | R4.1 36.92,36.07 38.61,36.07 39.37,36.83 44.7,36.83 44.7,32.51 41.82,32.51 C5.1
N$9
  Top 0.254: LED1.C R6.2
N$10
  Top 0.254: R6.1 R4.2 | R5.2 27.52,37.68 R4.2 | R4.2 43.18,37.68 C6.1
N$11
  Top 0.254: C8.2 R8.1
N$12
  Top 0.254: C7.2 R7.1
N$13  (via drill 0.6)
  Top 0.254: MIXER.2 74.93,42.76 R9.1 | R8.2 21.17,35.22 v23.62,32.77 | R7.2 51.65,32.85 v51.56,32.77
  Bottom 0.254: v23.62,32.77 v51.56,32.77 53.34,34.54 74.93,34.54 MIXER.2
N$14
  Top 0.254: MIXER.1 77.47,42.76 R9.2 76.96,43.18 76.96,44.96 71.97,44.96 R10.2 | C10.1 77.47,43.18
  Top 0.406: 77.47,43.18 77.47,42.76
N$15
  Top 0.254: R11.2 58,38.95 C9.1 R12.2 66.04,38.95 66.04,35.05 72.39,35.05 MIXER.3
N$16
  Top 0.254: AMP1.1 96.52,39.37 C12.1
N$17
  Top 0.254: C12.2 96.52,44.45 R14.2
N$18
  Top 0.254: R13.2 88.9,34.02 D2.A D3.C 99.06,34.02 AMP1.3
N$19  (via drill 0.6)
  Top 0.254: AMP1.5 R15.2 | R14.1 103.89,44.45 v103.89,42.42
  Bottom 0.254: C15.1 116.84,31.75 AMP1.5 103.89,31.75 v103.89,42.42
N$20
  Top 0.254: AMP1.7 C11.1
N$21
  Top 0.254: R15.1 106.68,26.67 C13.1
N$22
  Top 0.254: C17.2 R17.1
N$23
  Top 0.254: C16.2 R16.1
N$24
  Top 0.254: R20.2 58,27.09 C18.1 R21.2 69.85,27.09 MIXER.5
N$25  (via drill 0.6)
  Top 0.254: R17.2 21.17,24.38 | 21.17,24.38 R16.2 | v24.89,24.38 21.17,24.38 | R18.1 70.78,27.6 MIXER.6
  Bottom 0.254: v24.89,24.38 39.12,24.38 39.12,30.73 72.39,30.73 MIXER.6
N$26
  Top 0.254: MIXER.7 74.93,22.86 R19.2 | R19.2 R18.2 | C19.1 80.52,22.86 80.52,20.57 74.84,20.57 R19.2
N$27
  Top 0.254: R22.2 92.71,16.51 D4.A D5.C 97.54,16.24 97.54,11.43 AMP2.3
N$28
  Top 0.254: AMP2.7 C20.1
N$29
  Top 0.254: AMP2.1 99.06,19.47 C21.1
N$30
  Top 0.254: C21.2 96.52,21.59 R23.2
N$31  (via drill 0.6)
  Top 0.254: R24.2 AMP2.5 | R23.1 103.72,20.07 v103.63,20.07
  Bottom 0.254: C24.1 AMP2.5 103.63,8.89 v103.63,20.07
N$32
  Top 0.254: 106.68,3.81 C22.1
  Top 0.406: R24.1 106.68,3.81
N$34
  Top 0.254: R27.2 LED2.A
N$35
  Top 0.254: R28.2 145.29,44.45 LED3.A
N$36
  Top 0.254: R29.2 147.07,40.64 LED4.A
N$37
  Top 0.254: AMP3.7 43.18,16.93 C25.1
N$38
  Top 0.254: AMP3.1 40.64,5.08 C26.1
N$39
  Top 0.254: C26.2 35.56,5.08 R33.2
N$40
  Top 0.254: 48.26,16.76 AMP3.5 48.26,14.22 R34.2 | 48.26,16.76 C29.1 | R33.1 44.45,11.01 44.45,16.76 48.26,16.76
N$41
  Top 0.254: R34.1 53.34,14.22 C27.1
N$42
  Top 0.254: C30.2 20.32,27.94 20.32,15.49 25.4,15.49 R32.1
PHONE_MIC  (via drill 0.6)
  Top 0.254: PHONE.4 12.28,25.4 R25.2 15.49,24.98 v15.49,24.89
  Bottom 0.254: v15.49,24.89 15.49,23.37 40.13,23.37 40.13,27.69 115.06,27.69 115.06,26.42 121.88,26.42 C15.2
PHONE_SPKR
  Top 0.254: PHONE.1 C16.1
TAB
  pour Top (isolate 0.254): 24.89,61.72 14.73,61.72 14.73,62.99 10.92,62.99 10.92,70.1 48.26,70.1 48.26,61.72

### Text on the board
tNames: DL | TS | GND | PHONE | Brad Box V4 | HSET | LSPKR | LS | WW